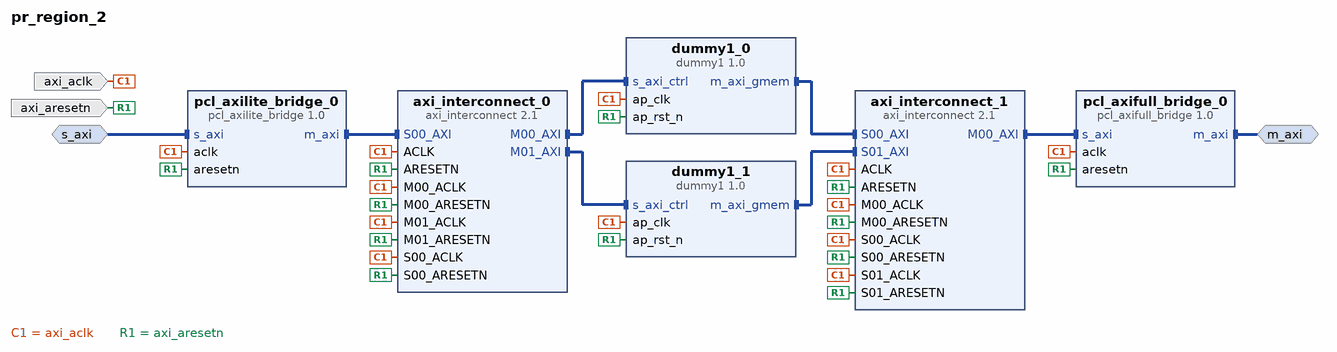
[diagram p0: block diagram of the top level]
# Vivado block design pr_region_2, xcvu095-ffvc1517-2-e, Vivado 2017.2
create_bd_design pr_region_2

create_bd_intf_port -mode Master -vlnv xilinx.com:interface:aximm_rtl:1.0 m_axi
set_property -dict [list \
  CONFIG.DATA_WIDTH 128 \
  CONFIG.PROTOCOL AXI4 \
  CONFIG.FREQ_HZ 250000000 \
  CONFIG.ADDR_WIDTH 64 \
  CONFIG.HAS_BURST 0 \
  CONFIG.HAS_REGION 0 \
  CONFIG.CLK_DOMAIN static_region_xdma_0_0_axi_aclk \
] [get_bd_intf_ports m_axi]
create_bd_intf_port -mode Slave -vlnv xilinx.com:interface:aximm_rtl:1.0 s_axi
set_property -dict [list \
  CONFIG.DATA_WIDTH 32 \
  CONFIG.PROTOCOL AXI4LITE \
  CONFIG.FREQ_HZ 250000000 \
  CONFIG.ID_WIDTH 0 \
  CONFIG.ADDR_WIDTH 32 \
  CONFIG.AWUSER_WIDTH 0 \
  CONFIG.ARUSER_WIDTH 0 \
  CONFIG.WUSER_WIDTH 0 \
  CONFIG.RUSER_WIDTH 0 \
  CONFIG.BUSER_WIDTH 0 \
  CONFIG.READ_WRITE_MODE READ_WRITE \
  CONFIG.HAS_BURST 0 \
  CONFIG.HAS_LOCK 0 \
  CONFIG.HAS_PROT 1 \
  CONFIG.HAS_CACHE 0 \
  CONFIG.HAS_QOS 1 \
  CONFIG.HAS_REGION 0 \
  CONFIG.HAS_WSTRB 1 \
  CONFIG.HAS_BRESP 1 \
  CONFIG.HAS_RRESP 1 \
  CONFIG.SUPPORTS_NARROW_BURST 0 \
  CONFIG.NUM_READ_OUTSTANDING 1 \
  CONFIG.NUM_WRITE_OUTSTANDING 1 \
  CONFIG.MAX_BURST_LENGTH 1 \
  CONFIG.CLK_DOMAIN static_region_xdma_0_0_axi_aclk \
  CONFIG.NUM_READ_THREADS 1 \
  CONFIG.NUM_WRITE_THREADS 1 \
  CONFIG.RUSER_BITS_PER_BYTE 0 \
  CONFIG.WUSER_BITS_PER_BYTE 0 \
] [get_bd_intf_ports s_axi]
create_bd_port -dir I -type clk axi_aclk
set_property -dict {CONFIG.FREQ_HZ 250000000 CONFIG.CLK_DOMAIN static_region_xdma_0_0_axi_aclk} [get_bd_ports axi_aclk]
create_bd_port -dir I -type rst axi_aresetn

create_bd_cell -type ip -vlnv xilinx.com:ip:axi_interconnect:2.1 axi_interconnect_0
set_property -dict {CONFIG.NUM_MI 2} [get_bd_cells axi_interconnect_0]
create_bd_cell -type ip -vlnv xilinx.com:ip:axi_interconnect:2.1 axi_interconnect_1
set_property -dict {CONFIG.NUM_SI 2 CONFIG.NUM_MI 1} [get_bd_cells axi_interconnect_1]
create_bd_cell -type ip -vlnv xilinx.com:hls:dummy1:1.0 dummy1_0
create_bd_cell -type ip -vlnv xilinx.com:hls:dummy1:1.0 dummy1_1
create_bd_cell -type ip -vlnv xilinx.com:ip:pcl_axifull_bridge:1.0 pcl_axifull_bridge_0
set_property -dict {CONFIG.DATA_WIDTH 128 CONFIG.ADDR_WIDTH 64} [get_bd_cells pcl_axifull_bridge_0]
create_bd_cell -type ip -vlnv xilinx.com:ip:pcl_axilite_bridge:1.0 pcl_axilite_bridge_0
set_property -dict {CONFIG.ADDR_WIDTH 19} [get_bd_cells pcl_axilite_bridge_0]

# ---- connections ----

connect_bd_intf_net [get_bd_intf_pins axi_interconnect_1/S00_AXI] [get_bd_intf_pins dummy1_0/m_axi_gmem]
connect_bd_intf_net [get_bd_intf_pins axi_interconnect_0/S00_AXI] [get_bd_intf_pins pcl_axilite_bridge_0/m_axi]
connect_bd_intf_net [get_bd_intf_pins axi_interconnect_0/M00_AXI] [get_bd_intf_pins dummy1_0/s_axi_ctrl]
connect_bd_intf_net [get_bd_intf_pins axi_interconnect_0/M01_AXI] [get_bd_intf_pins dummy1_1/s_axi_ctrl]
connect_bd_intf_net [get_bd_intf_pins axi_interconnect_1/M00_AXI] [get_bd_intf_pins pcl_axifull_bridge_0/s_axi]
connect_bd_intf_net [get_bd_intf_pins axi_interconnect_1/S01_AXI] [get_bd_intf_pins dummy1_1/m_axi_gmem]
connect_bd_intf_net -intf_net pr_region_m_axi [get_bd_intf_ports m_axi] [get_bd_intf_pins pcl_axifull_bridge_0/m_axi]
connect_bd_intf_net [get_bd_intf_ports s_axi] [get_bd_intf_pins pcl_axilite_bridge_0/s_axi]
connect_bd_net -net S00_ACLK_1 [get_bd_ports axi_aclk] \
  [get_bd_pins axi_interconnect_0/ACLK] [get_bd_pins axi_interconnect_0/M00_ACLK] [get_bd_pins axi_interconnect_0/M01_ACLK] \
  [get_bd_pins axi_interconnect_0/S00_ACLK] [get_bd_pins axi_interconnect_1/ACLK] [get_bd_pins axi_interconnect_1/M00_ACLK] \
  [get_bd_pins axi_interconnect_1/S00_ACLK] [get_bd_pins axi_interconnect_1/S01_ACLK] [get_bd_pins dummy1_0/ap_clk] \
  [get_bd_pins dummy1_1/ap_clk] [get_bd_pins pcl_axifull_bridge_0/aclk] [get_bd_pins pcl_axilite_bridge_0/aclk]
connect_bd_net -net S00_ARESETN_1 [get_bd_ports axi_aresetn] \
  [get_bd_pins axi_interconnect_0/ARESETN] [get_bd_pins axi_interconnect_0/M00_ARESETN] \
  [get_bd_pins axi_interconnect_0/M01_ARESETN] [get_bd_pins axi_interconnect_0/S00_ARESETN] \
  [get_bd_pins axi_interconnect_1/ARESETN] [get_bd_pins axi_interconnect_1/M00_ARESETN] \
  [get_bd_pins axi_interconnect_1/S00_ARESETN] [get_bd_pins axi_interconnect_1/S01_ARESETN] [get_bd_pins dummy1_0/ap_rst_n] \
  [get_bd_pins dummy1_1/ap_rst_n] [get_bd_pins pcl_axifull_bridge_0/aresetn] [get_bd_pins pcl_axilite_bridge_0/aresetn]

# ---- address map ----
assign_bd_address -offset 0x0000000000000000 -range 8G -target_address_space [get_bd_addr_spaces dummy1_0/Data_m_axi_gmem] [get_bd_addr_segs m_axi/Reg]
assign_bd_address -offset 0x0000000000000000 -range 8G -target_address_space [get_bd_addr_spaces dummy1_1/Data_m_axi_gmem] [get_bd_addr_segs m_axi/Reg]
assign_bd_address -offset 0x00000000 -range 64K -target_address_space [get_bd_addr_spaces s_axi] [get_bd_addr_segs dummy1_1/s_axi_ctrl/Reg]
assign_bd_address -offset 0x00010000 -range 64K -target_address_space [get_bd_addr_spaces s_axi] [get_bd_addr_segs dummy1_0/s_axi_ctrl/Reg]

validate_bd_design
save_bd_design
